# EAGLE design robot (EAGLE 6.1)

## Sheet 1 of 6
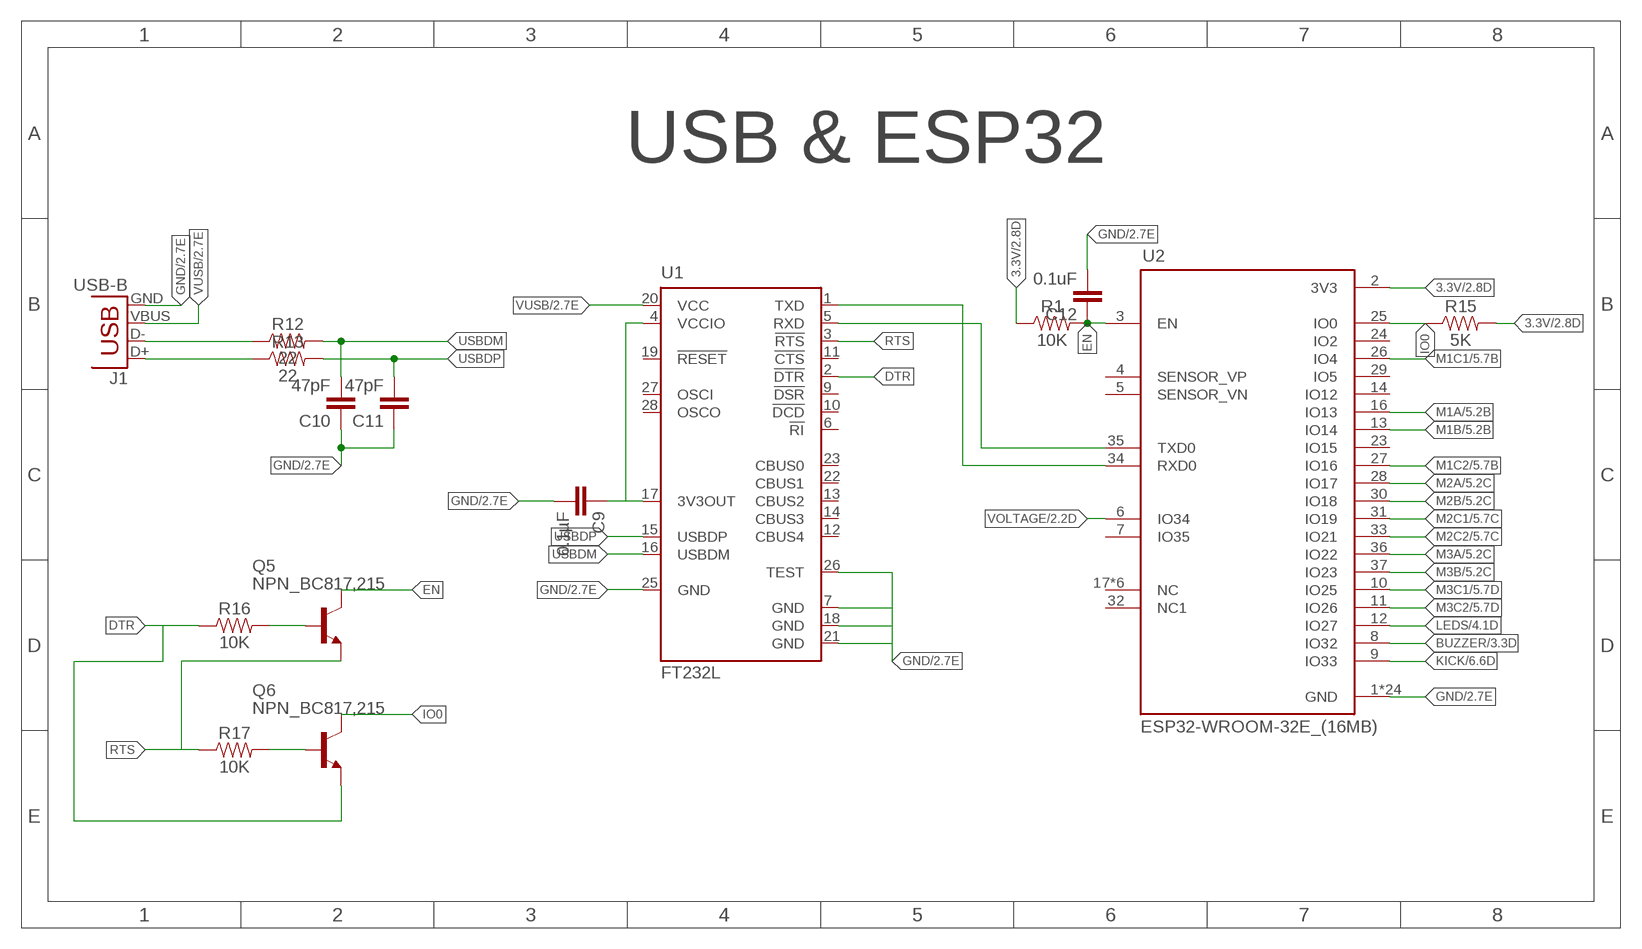
[diagram p0: schematic, sheet 1]

### Parts
C9  0.1µF  0.33UF/330NF-0805-50V-10%  [0805]
C10  47pF  CAP0805  [0805]
C11  47pF  CAP0805  [0805]
C12  0.1uF  CAP0805  [0805]
J1  USB-B  USBPTH  [USB-B-PTH]
Q5  NPN_BC817,215  [SOT-23]
Q6  NPN_BC817,215  [SOT-23]
R1  10K  0.3OHM-0805-1/8W-1%  [0805]
R12  22  0.3OHM-0805-1/8W-1%  [0805]
R13  22  0.3OHM-0805-1/8W-1%  [0805]
R15  5K  0.3OHM-0805-1/8W-1%  [0805]
R16  10K  0.3OHM-0805-1/8W-1%  [0805]
R17  10K  0.3OHM-0805-1/8W-1%  [0805]
U1  FT232L  [SSOP28]
U2  ESP32-WROOM-32E_(16MB)  [MODULE_ESP32-WROOM-32E_(16MB)]

### Nets
3.3V: R1.1 R15.2 U2.2(3V3) ; also sheet 2,3,5
BUZZER: U2.8(IO32) ; also sheet 3
DTR: Q6.2(E) R16.1 U1.2(!DTR)
EN: C12.1 Q5.3(C) R1.2 U2.3(EN)
GND [alime]: C9.2 C10.1 C11.1 C12.2 J1.GND U1.7(GND) U1.18(GND) U1.21(GND) U1.25(GND) U1.26(TEST) U2.1(GND) U2.15(GND) U2.38(GND) U2.39_1(GND) U2.39_2(GND) U2.39_3(GND) U2.39_4(GND) U2.39_5(GND) U2.39_6(GND) U2.39_7(GND) U2.39_8(GND) U2.39_9(GND) U2.39_10(GND) U2.39_11(GND) U2.39_12(GND) U2.39_13(GND) U2.39_14(GND) U2.39_15(GND) U2.39_16(GND) U2.39_17(GND) U2.39_18(GND) U2.39_19(GND) U2.39_20(GND) U2.39_21(GND) ; also sheet 2,3,4,5,6
IO0: Q6.3(C) R15.1 U2.25(IO0)
KICK: U2.9(IO33) ; also sheet 6
LEDS: U2.12(IO27) ; also sheet 4
M1A: U2.16(IO13) ; also sheet 5
M1B: U2.13(IO14) ; also sheet 5
M1C1: U2.26(IO4) ; also sheet 5
M1C2: U2.27(IO16) ; also sheet 5
M2A: U2.28(IO17) ; also sheet 5
M2B: U2.30(IO18) ; also sheet 5
M2C1: U2.31(IO19) ; also sheet 5
M2C2: U2.33(IO21) ; also sheet 5
M3A: U2.36(IO22) ; also sheet 5
M3B: U2.37(IO23) ; also sheet 5
M3C1: U2.10(IO25) ; also sheet 5
M3C2: U2.11(IO26) ; also sheet 5
N$6: U1.1(TXD) U2.34(RXD0)
N$14: U1.5(RXD) U2.35(TXD0)
N$15: C9.1 U1.4(VCCIO) U1.17(3V3OUT)
N$16: Q5.1(B) R16.2
N$17: Q6.1(B) R17.2
N$59: J1.D- R12.1
N$60: J1.D+ R13.1
RTS: Q5.2(E) R17.1 U1.3(!RTS)
USBDM: C10.2 R12.2 U1.16(USBDM)
USBDP: C11.2 R13.2 U1.15(USBDP)
VOLTAGE: U2.6(IO34) ; also sheet 2
VUSB [alime]: J1.VBUS U1.20(VCC) ; also sheet 2
Unconnected: U1.6(!RI) U1.9(!DSR) U1.10(!DCD) U1.11(!CTS) U1.12(CBUS4) U1.13(CBUS2) U1.14(CBUS3) U1.19(!RESET) U1.22(CBUS1) U1.23(CBUS0) U1.27(OSCI) U1.28(OSCO) U2.4(SENSOR_VP) U2.5(SENSOR_VN) U2.7(IO35) U2.14(IO12) U2.17(NC) U2.18(NC) U2.19(NC) U2.20(NC) U2.21(NC) U2.22(NC) U2.23(IO15) U2.24(IO2) U2.29(IO5) U2.32(NC1)

### Notes on the sheet
- USB & ESP32

## Sheet 2 of 6
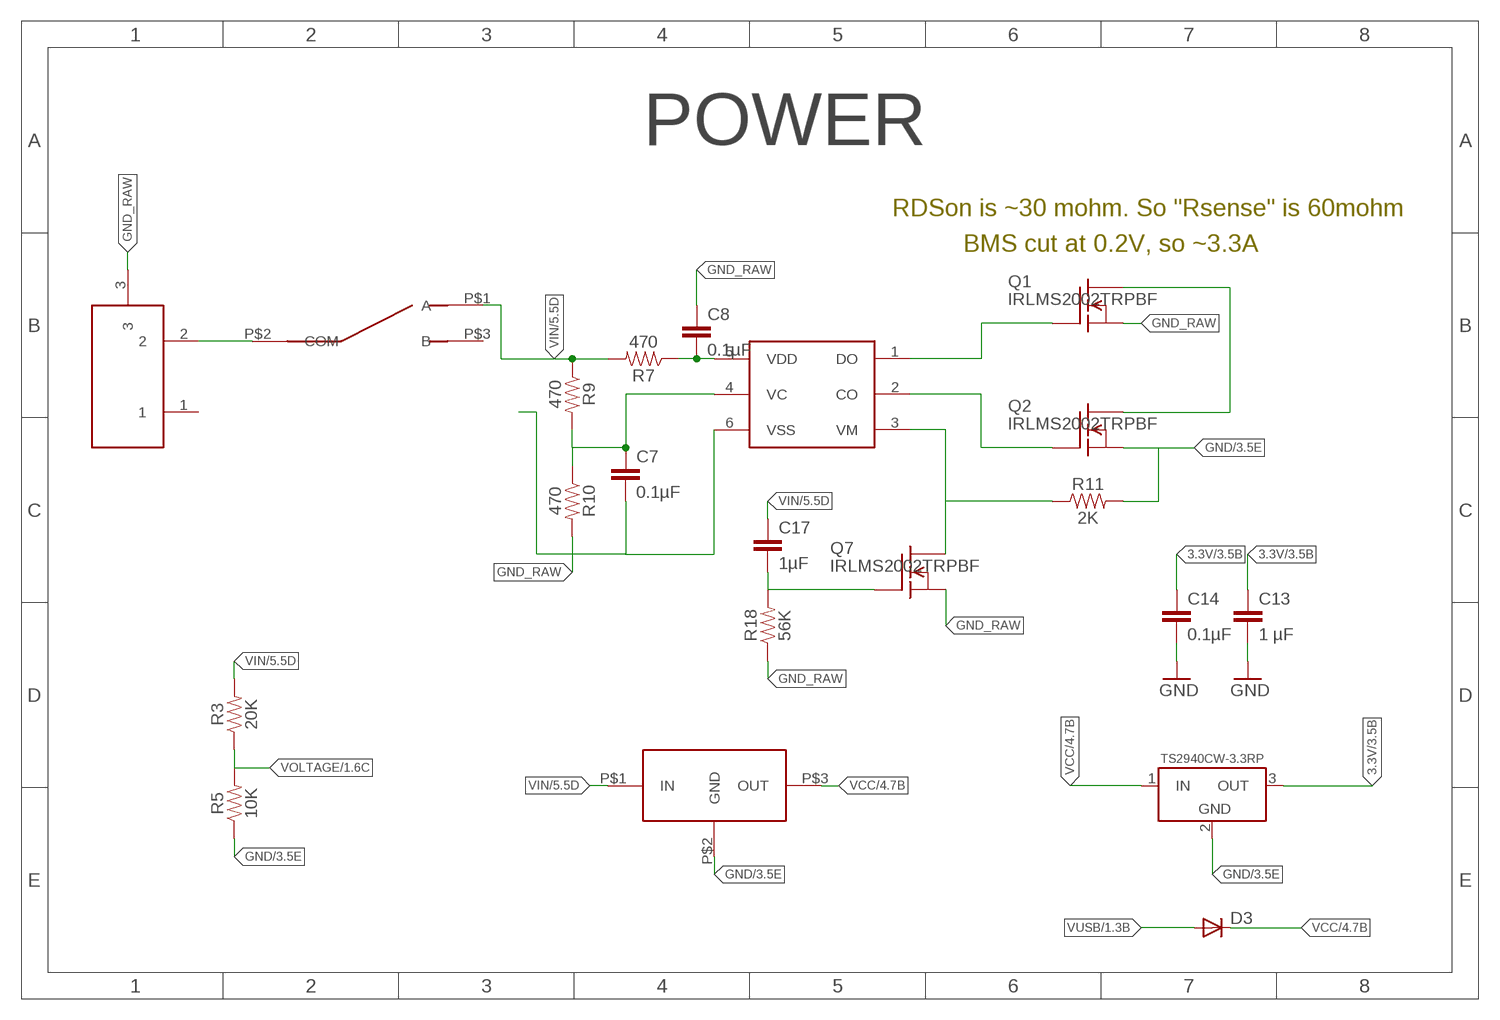
[diagram p1: schematic, sheet 2]

### Parts
C7  0.1µF  0.33UF/330NF-0805-50V-10%  [0805]
C8  0.1µF  0.33UF/330NF-0805-50V-10%  [0805]
C13  1 µF  0.33UF/330NF-0805-50V-10%  [0805]
C14  0.1µF  0.33UF/330NF-0805-50V-10%  [0805]
C17  1µF  0.33UF/330NF-0805-50V-10%  [0805]
D3  DIODESOD  [SOD-323]
J2  DC21MMX  [DC-21MM]
Q1  IRLMS2002TRPBF  [SOT23-6]
Q2  IRLMS2002TRPBF  [SOT23-6]
Q7  IRLMS2002TRPBF  [SOT23-6]
R3  20K  0.3OHM-0805-1/8W-1%  [0805]
R5  10K  0.3OHM-0805-1/8W-1%  [0805]
R7  470  0.3OHM-0805-1/8W-1%  [0805]
R9  470  0.3OHM-0805-1/8W-1%  [0805]
R10  470  0.3OHM-0805-1/8W-1%  [0805]
R11  2K  0.3OHM-0805-1/8W-1%  [0805]
R18  56K  0.3OHM-0805-1/8W-1%  [0805]
REG1  REG_5V  [TRACOPOWER]
U3  S8252  [SOT23-6]
U$1  L102011ML04Q  [L102011ML04Q]
U$25  TS2940CW-3.3RP  [SOT223]

### Nets
3.3V: C13.1 C14.1 U$25.3(OUT) ; also sheet 1,3,5
GND [alime]: C13.2 C14.2 Q2.4(S) R5.1 R11.2 REG1.P$2(GND) U$25.2(GND) ; also sheet 1,3,4,5,6
GND_RAW [alime]: C7.2 C8.1 J2.3 Q1.4(S) Q7.4(S) R10.2 R18.1 U3.6(VSS)
N$7 [alime]: J2.2 U$1.P$2(COM)
N$8: C8.2 R7.1 U3.5(VDD)
N$9: C7.1 R9.2 R10.1 U3.4(VC)
N$10: Q1.1(D) Q1.2(D) Q1.5(D) Q1.6(D) Q2.1(D) Q2.2(D) Q2.5(D) Q2.6(D)
N$11: Q2.3(G) U3.2(CO)
N$12: Q1.3(G) U3.1(DO)
N$13: Q7.1(D) Q7.2(D) Q7.5(D) Q7.6(D) R11.1 U3.3(VM)
N$19: C17.2 Q7.3(G) R18.2
VCC [alime]: D3.1(C) REG1.P$3(OUT) U$25.1(IN) ; also sheet 4
VIN [alime]: C17.1 R3.2 R7.2 R9.1 REG1.P$1(IN) U$1.P$1(A) ; also sheet 5,6
VOLTAGE: R3.1 R5.2 ; also sheet 1
VUSB [alime]: D3.2(A) ; also sheet 1
Unconnected: U$1.P$3(B)

### Notes on the sheet
- POWER
- RDSon is ~30 mohm. So "Rsense" is 60mohm
- BMS cut at 0.2V, so ~3.3A

## Sheet 3 of 6
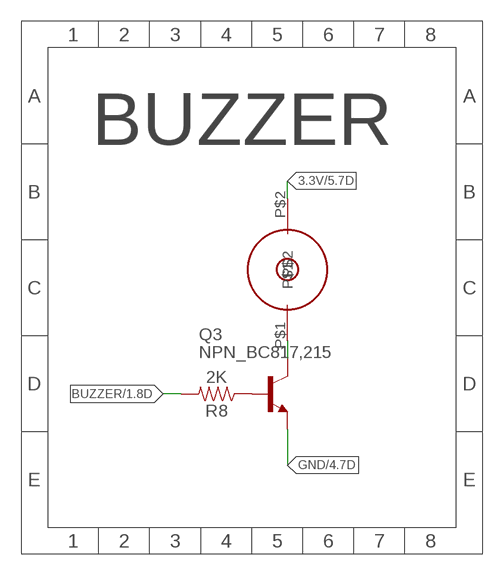
[diagram p2: schematic, sheet 3]

### Parts
B1  BUZZER66  [BUZZER66]
Q3  NPN_BC817,215  [SOT-23]
R8  2K  0.3OHM-0805-1/8W-1%  [0805]

### Nets
3.3V: B1.P$2 ; also sheet 1,2,5
BUZZER: R8.2 ; also sheet 1
GND [alime]: Q3.2(E) ; also sheet 1,2,4,5,6
N$3: Q3.1(B) R8.1
N$5: B1.P$1 Q3.3(C)

### Notes on the sheet
- BUZZER

## Sheet 4 of 6
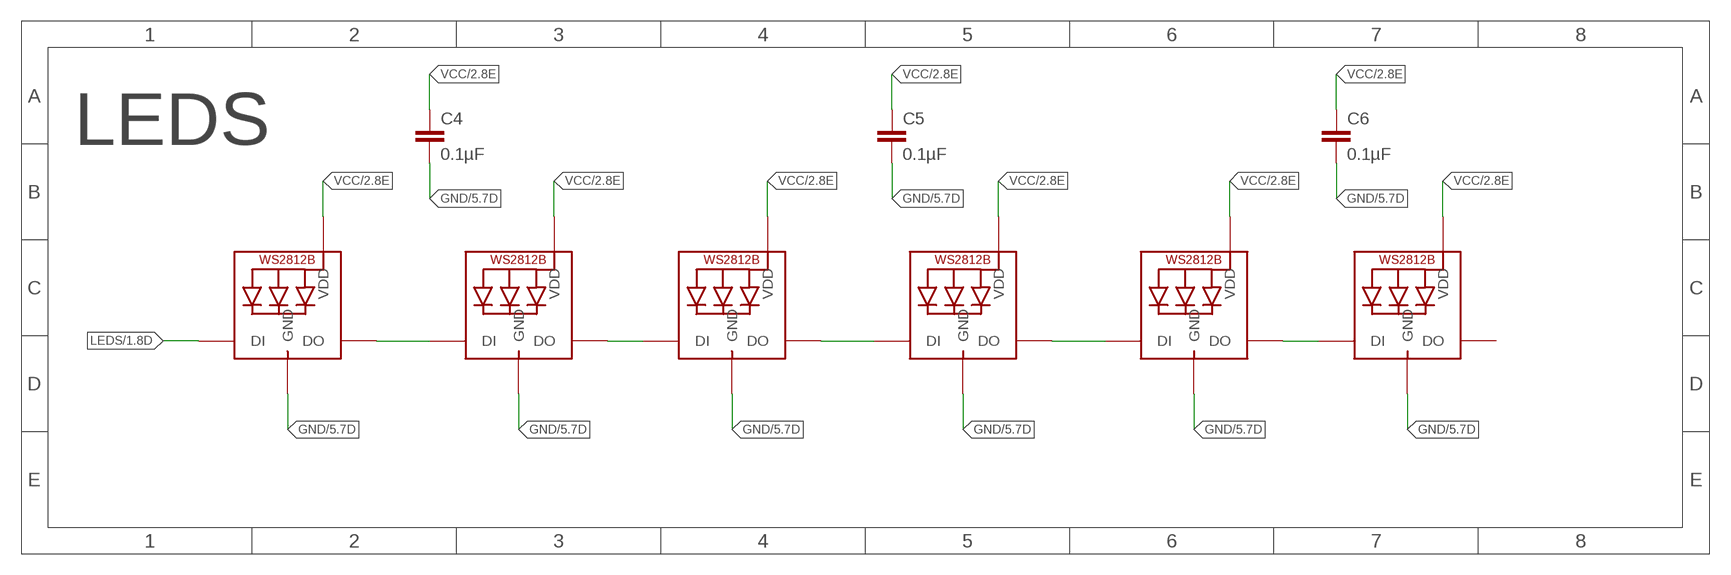
[diagram p3: schematic, sheet 4]

### Parts
C4  0.1µF  0.33UF/330NF-0805-50V-10%  [0805]
C5  0.1µF  0.33UF/330NF-0805-50V-10%  [0805]
C6  0.1µF  0.33UF/330NF-0805-50V-10%  [0805]
LED1  WS2812B5050  [WS2812B]
LED2  WS2812B5050  [WS2812B]
LED3  WS2812B5050  [WS2812B]
LED4  WS2812B5050  [WS2812B]
LED5  WS2812B5050  [WS2812B]
LED6  WS2812B5050  [WS2812B]

### Nets
GND [alime]: C4.2 C5.2 C6.2 LED1.3-GND(GND) LED2.3-GND(GND) LED3.3-GND(GND) LED4.3-GND(GND) LED5.3-GND(GND) LED6.3-GND(GND) ; also sheet 1,2,3,5,6
LEDS: LED1.4-DIN(DI) ; also sheet 1
N$27: LED1.2-DOUT(DO) LED2.4-DIN(DI)
N$28: LED2.2-DOUT(DO) LED3.4-DIN(DI)
N$30: LED4.2-DOUT(DO) LED5.4-DIN(DI)
N$32: LED5.2-DOUT(DO) LED6.4-DIN(DI)
N$39: LED3.2-DOUT(DO) LED4.4-DIN(DI)
VCC [alime]: C4.1 C5.1 C6.1 LED1.1-VDD(VDD) LED2.1-VDD(VDD) LED3.1-VDD(VDD) LED4.1-VDD(VDD) LED5.1-VDD(VDD) LED6.1-VDD(VDD) ; also sheet 2
Unconnected: LED6.2-DOUT(DO)

### Notes on the sheet
- LEDS

## Sheet 5 of 6
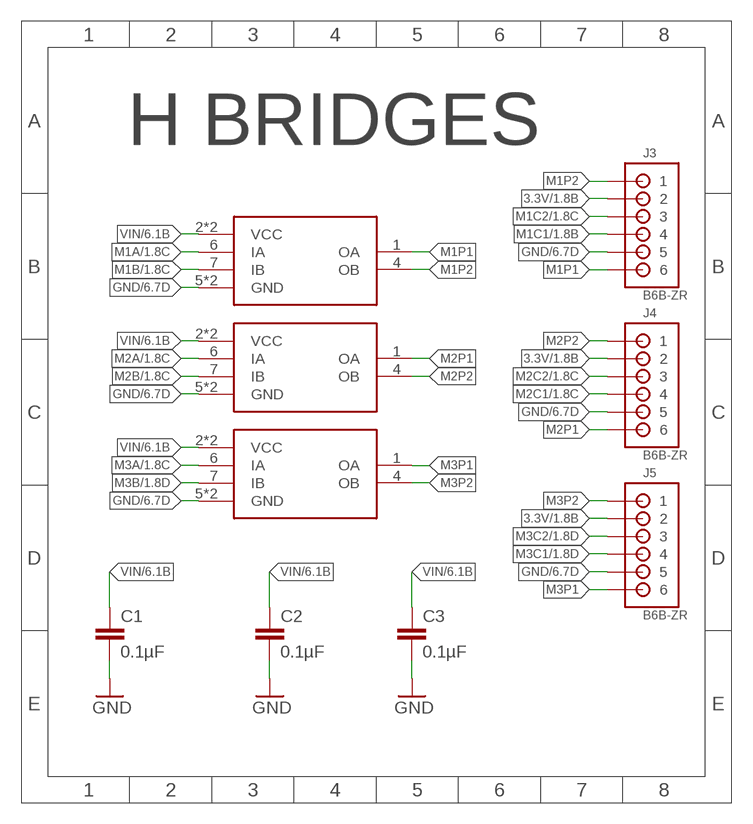
[diagram p4: schematic, sheet 5]

### Parts
C1  0.1µF  0.33UF/330NF-0805-50V-10%  [0805]
C2  0.1µF  0.33UF/330NF-0805-50V-10%  [0805]
C3  0.1µF  0.33UF/330NF-0805-50V-10%  [0805]
J3  B6B-ZR  [B6B-ZR]
J4  B6B-ZR  [B6B-ZR]
J5  B6B-ZR  [B6B-ZR]
U4  L9110  [SO8]
U5  L9110  [SO8]
U6  L9110  [SO8]

### Nets
3.3V: J3.2 J4.2 J5.2 ; also sheet 1,2,3
GND [alime]: C1.2 C2.2 C3.2 J3.5 J4.5 J5.5 U4.5(GND) U4.8(GND) U5.5(GND) U5.8(GND) U6.5(GND) U6.8(GND) ; also sheet 1,2,3,4,6
M1A: U4.6(IA) ; also sheet 1
M1B: U4.7(IB) ; also sheet 1
M1C1: J3.4 ; also sheet 1
M1C2: J3.3 ; also sheet 1
M1P1 [alime]: J3.6 U4.1(OA)
M1P2 [alime]: J3.1 U4.4(OB)
M2A: U5.6(IA) ; also sheet 1
M2B: U5.7(IB) ; also sheet 1
M2C1: J4.4 ; also sheet 1
M2C2: J4.3 ; also sheet 1
M2P1 [alime]: J4.6 U5.1(OA)
M2P2 [alime]: J4.1 U5.4(OB)
M3A: U6.6(IA) ; also sheet 1
M3B: U6.7(IB) ; also sheet 1
M3C1: J5.4 ; also sheet 1
M3C2: J5.3 ; also sheet 1
M3P1 [alime]: J5.6 U6.1(OA)
M3P2 [alime]: J5.1 U6.4(OB)
VIN [alime]: C1.1 C2.1 C3.1 U4.2(VCC) U4.3(VCC) U5.2(VCC) U5.3(VCC) U6.2(VCC) U6.3(VCC) ; also sheet 2,6

### Notes on the sheet
- H BRIDGES

## Sheet 6 of 6
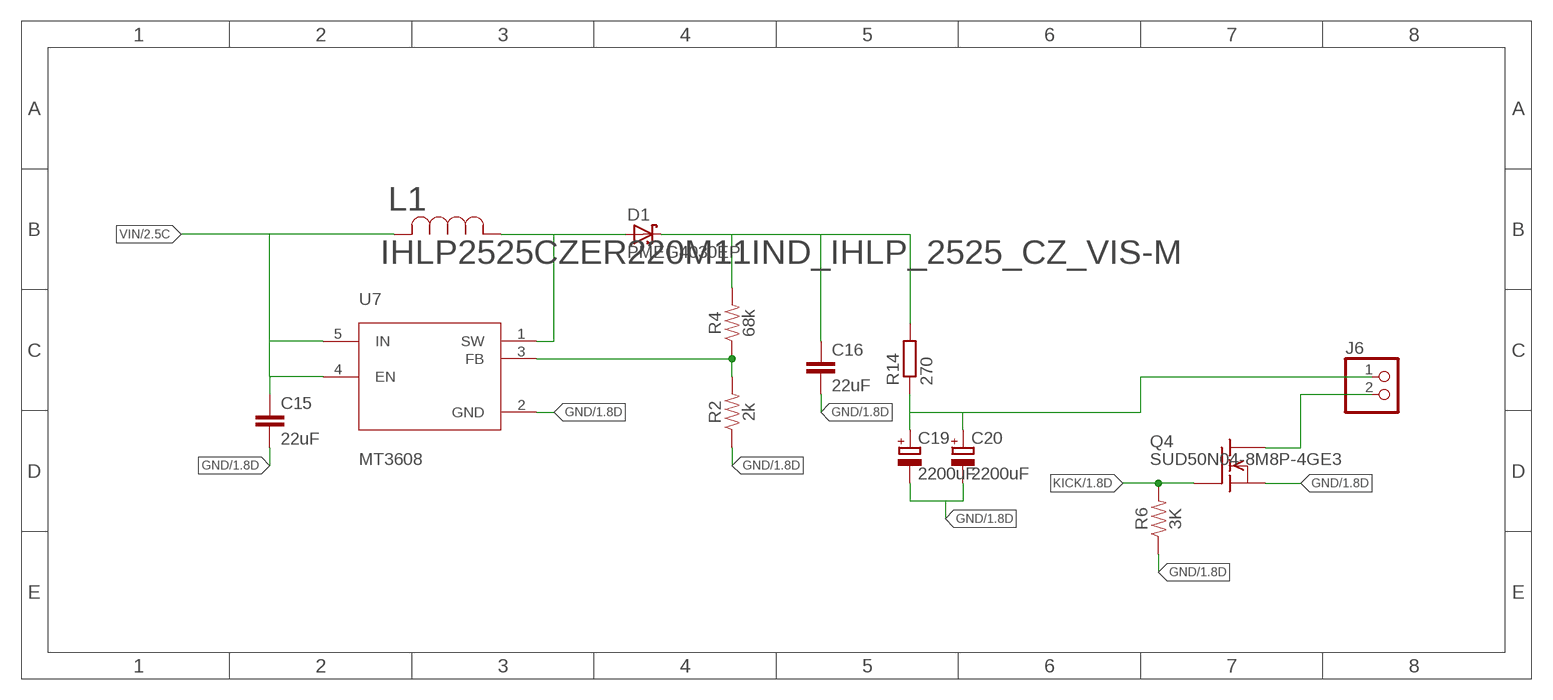
[diagram p5: schematic, sheet 6]

### Parts
C15  22uF  C-EUC0805  [C0805]
C16  22uF  C-EUC0805  [C0805]
C19  2200uF  CPOL-EUE5-13  [E5-13]
C20  2200uF  CPOL-EUE5-13  [E5-13]
D1  PMEG4030EP  [SOD128]
J6  KICKER  [KICKER]
L1  IHLP2525CZER220M11IND_IHLP_2525_CZ_VIS-M  [IND_IHLP_2525_CZ_VIS-M]
Q4  SUD50N04-8M8P-4GE3  [TO252]
R2  2k  0.3OHM-0805-1/8W-1%  [0805]
R4  68k  0.3OHM-0805-1/8W-1%  [0805]
R6  3K  0.3OHM-0805-1/8W-1%  [0805]
R14  270  R-EU_R2010  [R2010]
U7  MT3608  [SOT95P280X145-6N]

### Nets
GND [alime]: C15.2 C16.2 C19.- C20.- Q4.2(S) R2.1 R6.1 U7.2(GND) ; also sheet 1,2,3,4,5
KICK: Q4.1(G) R6.2 ; also sheet 1
KICKER: J6.2 Q4.3(D)
N$1: D1.2(A) L1.1 U7.1(SW)
N$2: C16.1 D1.1(K) R4.2 R14.2
N$4: R2.2 R4.1 U7.3(FB)
VIN [alime]: C15.1 L1.2 U7.4(EN) U7.5(IN) ; also sheet 2,5
VSTORE: C19.+ C20.+ J6.1 R14.1

## Power pins joined to a net without a drawn wire
1: J2.1

## Library data of the parts
B1 = rhoban:BUZZER; FARNELL: CEM-1203
C1-C9 C13 C14 = SparkFun-Capacitors:0.33UF/330NF: 0.33µF/330nF ceramic capacitors A capacitor is a passive two-terminal electrical component used to store electrical energy temporarily in an electric field.; FARNELL: 2688486RL; PROD_ID: CAP-08469; VALUE: 0.33µF
C10-C12 = SparkFun-Passives:CAP: Capacitor Standard 0603 ceramic capacitor, and 0.1" leaded capacitor.; FARNELL: 1081223
C15 C16 = resistor:C-EU: CAPACITOR, European symbol; FARNELL: 2666560
C17 = SparkFun-Capacitors:0.33UF/330NF: 0.33µF/330nF ceramic capacitors A capacitor is a passive two-terminal electrical component used to store electrical energy temporarily in an electric field.; FARNELL: 3010154; PROD_ID: CAP-08469; VALUE: 0.33µF
C19 C20 = rcl:CPOL-EU: POLARIZED CAPACITOR, European symbol; FARNELL: 2749341
D1 = nxp_60:PMEG4030E: 40 V, 3 A low VF MEGA Schottky barrier rectifier Planar Maximum Efficiency General Application (MEGA) Schottky barrier rectifier with an integrated guard ring for stress protection. AAL Eindhoven MK; FARNELL: 1829201
D3 = SparkFun-DiscreteSemi:DIODE: Diode These are standard reverse protection diodes and small signal diodes. SMA package can handle up to about 1A. SOD-323 can handle about 200mA. What the SOD-323 package when ordering, there are some mfgs out there that are 5-pin packages.; FARNELL: 8737843RL
J1 = SparkFun-Connectors:USB: USB Connectors USB-B-PTH is fully proven SKU : PRT-00139/CONN-08278 USB-miniB is fully proven SKU : PRT-00587 USB-A-PCB is untested. USB-A-H is throughly reviewed, but untested. Spark Fun Electronics SKU : PRT-00437 USB-B-SMT is throughly reviewed, but untested. Needs silkscreen touching up. USB-A-S has not been used/tested USB-MB-H has not been used/tested USB-MICROB has been used. CONN-09505; FARNELL: 1308876; PROD_ID: CONN-08278
J2 = powersupply:DC21MM; FARNELL: 1217037
J3-J5 = jst:B6B-ZR: JST-ZH Connector 6 pol, 1.5mm pitch Package: B6B-ZR Source: http://www.jst-mfg.com/product/pdf/eng/eZH.pdf; FARNELL: 9491805
J6 = rhoban:KICKER; FARNELL: JF-0530B
L1 = INDUCTOR:IHLP2525CZER220M11; BUILT_BY: EMA_UL_Team; FARNELL: 1741369; MANUFACTURER_PART_NUMBER: IHLP2525CZER220M11; SOURCELIBRARY: Vishay_2020-02-10; VENDOR: Vishay
LED1-LED6 = adafruit:WS2812B; FARNELL: WS2812B 5050
Q1 Q2 Q7 = rhoban:IRLMS2002TRPBF; FARNELL: 2577180RL
Q3 Q5 Q6 = rhoban:NPN; FARNELL: 1081223
Q4 = rhoban:SUD50N04-8M8P-4GE3; FARNELL: 1794799
R1 R12 R13 R15-R17 = SparkFun-Resistors:0.3OHM: 0.3Ω resistor A resistor is a passive two-terminal electrical component that implements electrical resistance as a circuit element. Resistors act to reduce current flow, and, at the same time, act to lower voltage levels within circuits. - Wikipedia; FARNELL: 2446926; PROD_ID: RES-11622; VALUE: 0.3
R2 R8 R11 = SparkFun-Resistors:0.3OHM: 0.3Ω resistor A resistor is a passive two-terminal electrical component that implements electrical resistance as a circuit element. Resistors act to reduce current flow, and, at the same time, act to lower voltage levels within circuits. - Wikipedia; FARNELL: 2447622; PROD_ID: RES-11622; VALUE: 0.3
R3 = SparkFun-Resistors:0.3OHM: 0.3Ω resistor A resistor is a passive two-terminal electrical component that implements electrical resistance as a circuit element. Resistors act to reduce current flow, and, at the same time, act to lower voltage levels within circuits. - Wikipedia; FARNELL: 2074395; PROD_ID: RES-11622; VALUE: 0.3
R4 = SparkFun-Resistors:0.3OHM: 0.3Ω resistor A resistor is a passive two-terminal electrical component that implements electrical resistance as a circuit element. Resistors act to reduce current flow, and, at the same time, act to lower voltage levels within circuits. - Wikipedia; FARNELL: 2447023; PROD_ID: RES-11622; VALUE: 0.3
R5 R9 R10 = SparkFun-Resistors:0.3OHM: 0.3Ω resistor A resistor is a passive two-terminal electrical component that implements electrical resistance as a circuit element. Resistors act to reduce current flow, and, at the same time, act to lower voltage levels within circuits. - Wikipedia; FARNELL: 2074334RL; PROD_ID: RES-11622; VALUE: 0.3
R6 = SparkFun-Resistors:0.3OHM: 0.3Ω resistor A resistor is a passive two-terminal electrical component that implements electrical resistance as a circuit element. Resistors act to reduce current flow, and, at the same time, act to lower voltage levels within circuits. - Wikipedia; FARNELL: 1887603; PROD_ID: RES-11622; VALUE: 0.3
R7 = SparkFun-Resistors:0.3OHM: 0.3Ω resistor A resistor is a passive two-terminal electrical component that implements electrical resistance as a circuit element. Resistors act to reduce current flow, and, at the same time, act to lower voltage levels within circuits. - Wikipedia; FARNELL: 2447662; PROD_ID: RES-11622; VALUE: 0.3
R14 = rcl:R-EU_: RESISTOR, European symbol; FARNELL: 1887603
R18 = SparkFun-Resistors:0.3OHM: 0.3Ω resistor A resistor is a passive two-terminal electrical component that implements electrical resistance as a circuit element. Resistors act to reduce current flow, and, at the same time, act to lower voltage levels within circuits. - Wikipedia; FARNELL: 2074486; PROD_ID: RES-11622; VALUE: 0.3
REG1 = rhoban:REG_5V; FARNELL: 1696320
U1 = rhoban:FT232: Source: http://www.ftdichip.com/Documents/DataSheets/DS_FT232R_v104.pdf; DATASHEET: ft232rl.pdf; FARNELL: 1146032; FARNELL_LINK: http://fr.farnell.com/ftdi/ft232rl/usb-vers-uart-cms-ssop28-232/dp/1146032?Ntt=1146032; MPN: FT232RL; OC_FARNELL: 1146032; OC_NEWARK: 91K9918
U2 = ESP32-WROOM-32E__16MB_:ESP32-WROOM-32E_(16MB): Bluetooth, WiFi 802.11b/g/n, Bluetooth v4.2 +EDR, Class 1, 2 and 3 Transceiver Module 2.4GHz ~ 2.5GHz Integrated, Trace Surface Mount Check availability; AVAILABILITY: In Stock; DESCRIPTION: Bluetooth, WiFi 802.11b/g/n, Bluetooth v4.2 +EDR, Class 1, 2 and 3 Transceiver Module 2.4GHz ~ 2.5GHz Integrated, Trace Surface Mount; FARNELL: ESP32-WROOM; MF: Espressif Systems; MP: ESP32-WROOM-32E (16MB); PACKAGE: SMD-44 Espressif Systems; PRICE: None
U3 = rhoban:S8252; FARNELL: https://www.digikey.fr/fr/products/detail/ablic-u-s-a-inc/S-8252AAL-M6T1U/6121452; REF: S-8252AAL-M6T1U
U4-U6 = rhoban:L9110; FARNELL: L9110 SOIC8
U7 = MT3608:MT3608: High Efficiency 1.2MHz 2A Step Up Converter Check prices; AVAILABILITY: No availability data; DESCRIPTION: High Efficiency 1.2MHz 2A Step Up Converter; FARNELL: MT3608; MF: Aerosemi Technology Co., Ltd; MP: MT3608; PACKAGE: Package; PRICE: None
U$1 = rhoban:L102011ML04Q
U$25 = rhoban:TS2940CW-3.3RP; FARNELL: 7261403

## Net classes
0 default: width 0.203 mm
1 alime: width 0.508 mm
2 bigalime: width 0.381 mm

## Board
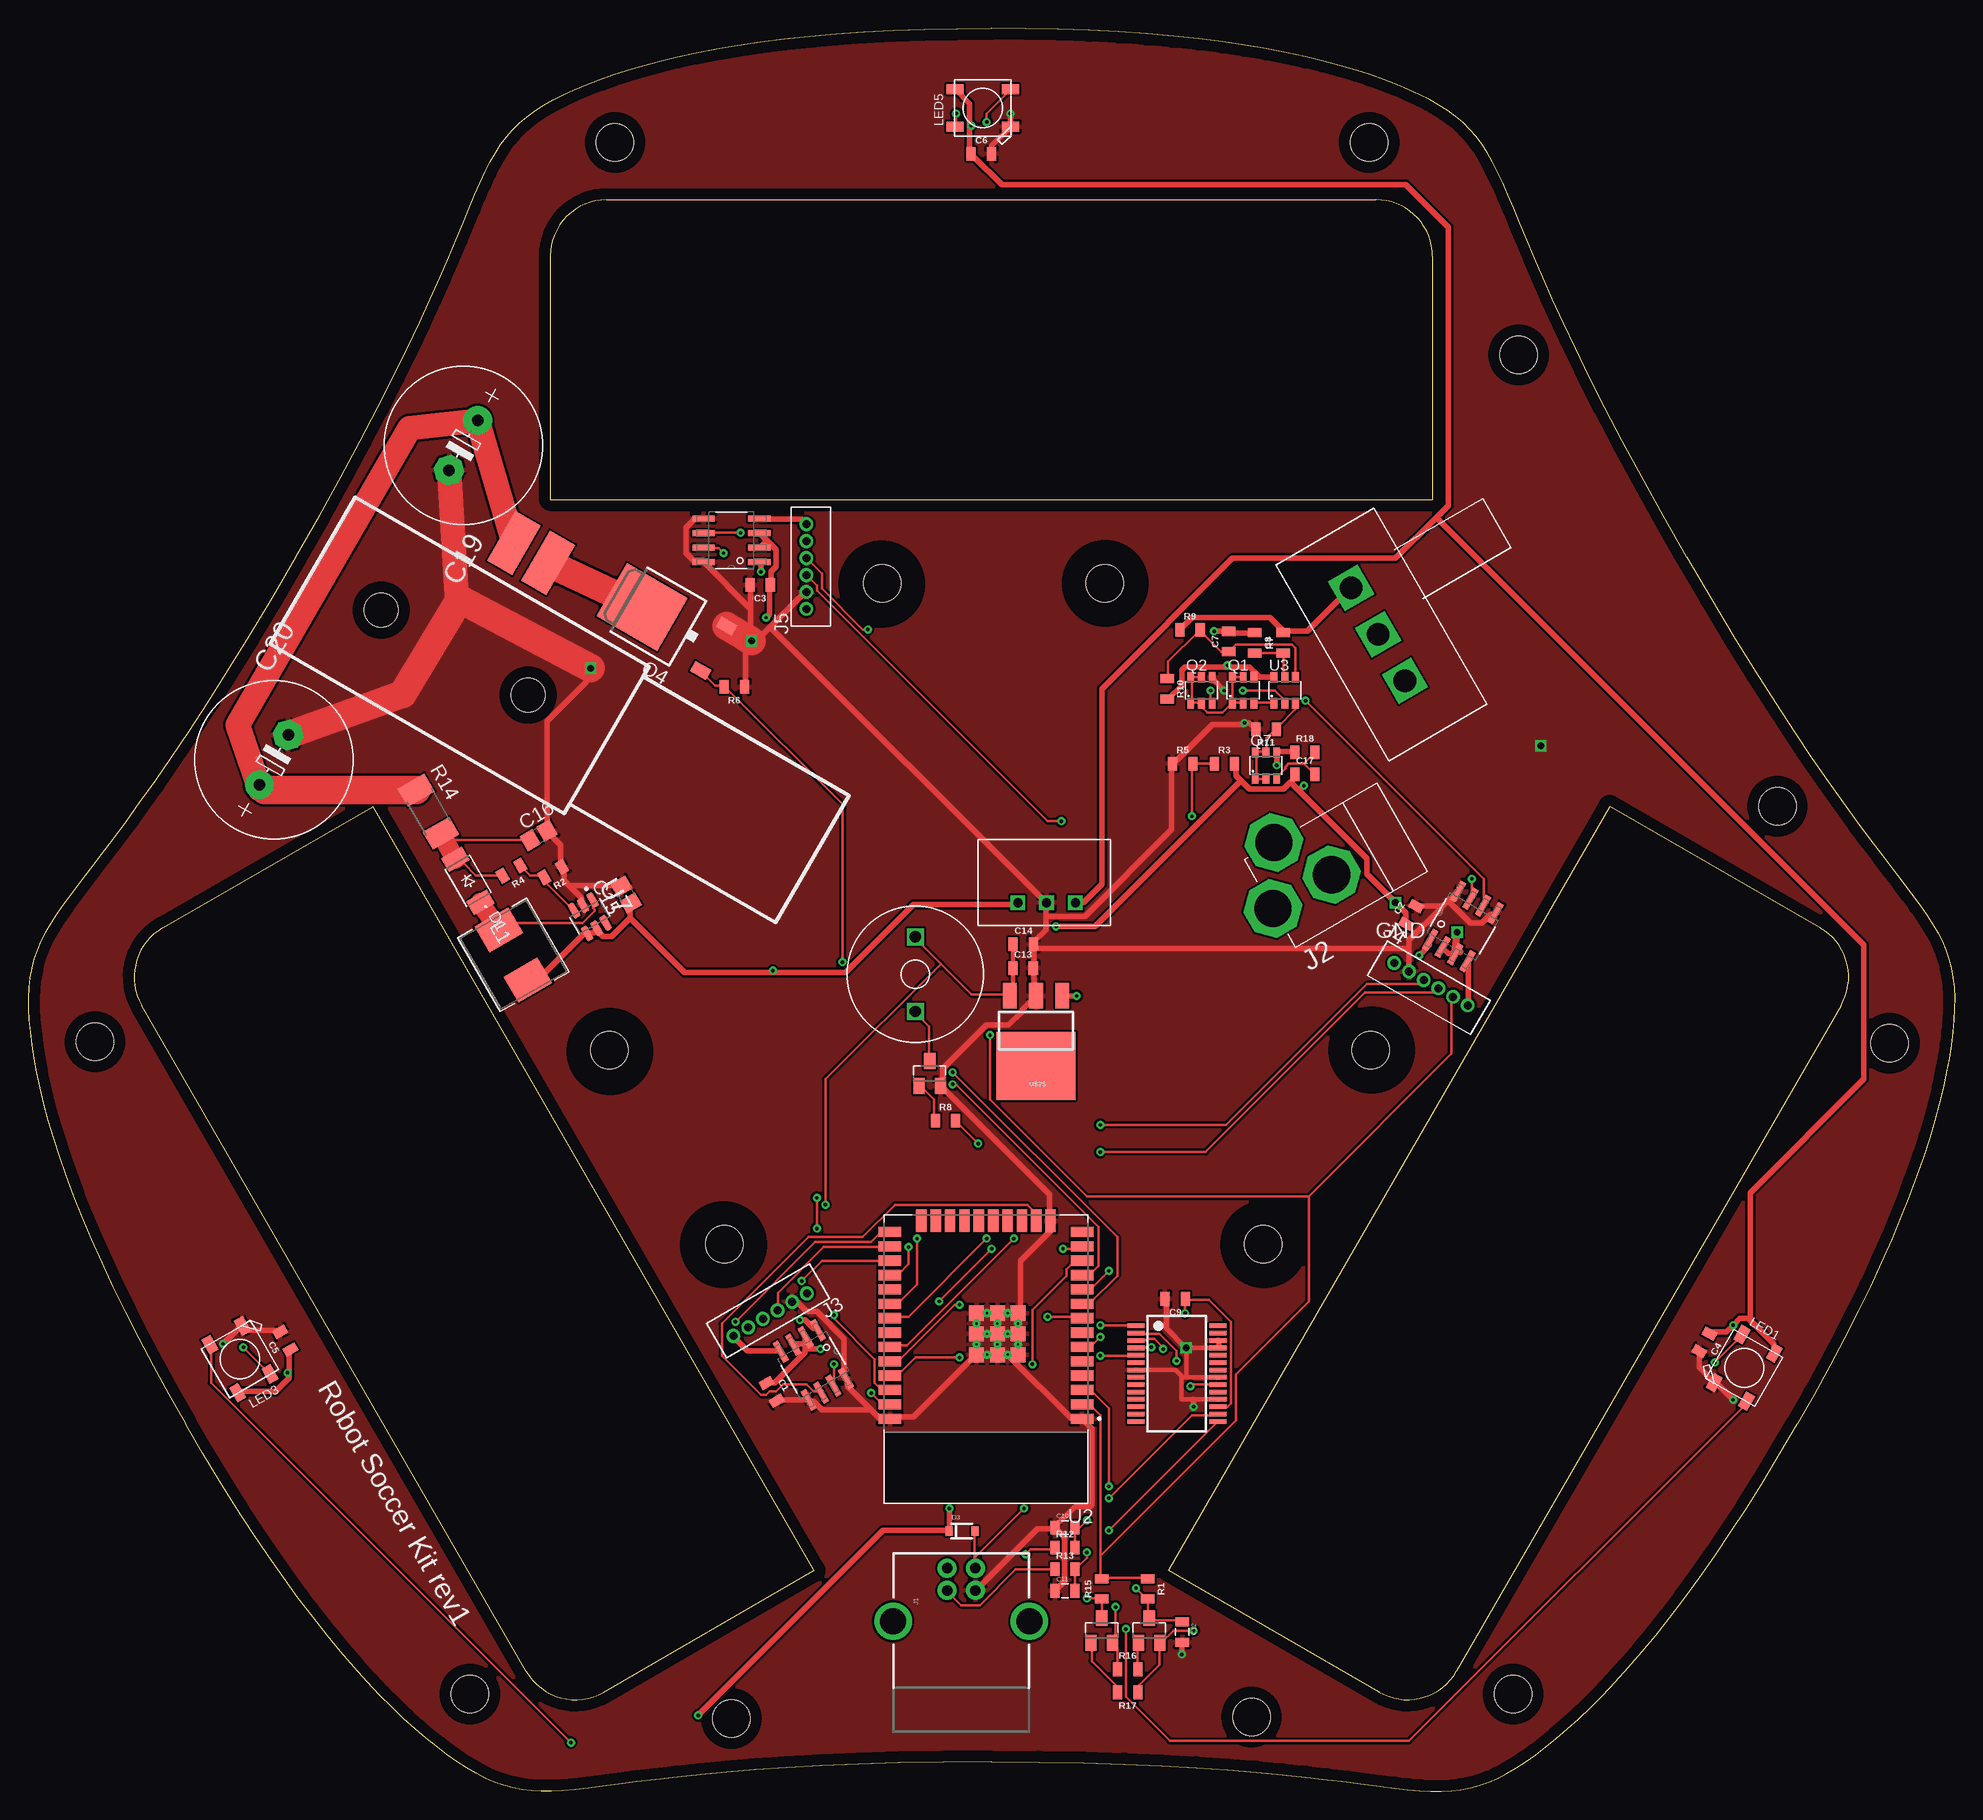
[diagram p6: board, top side]
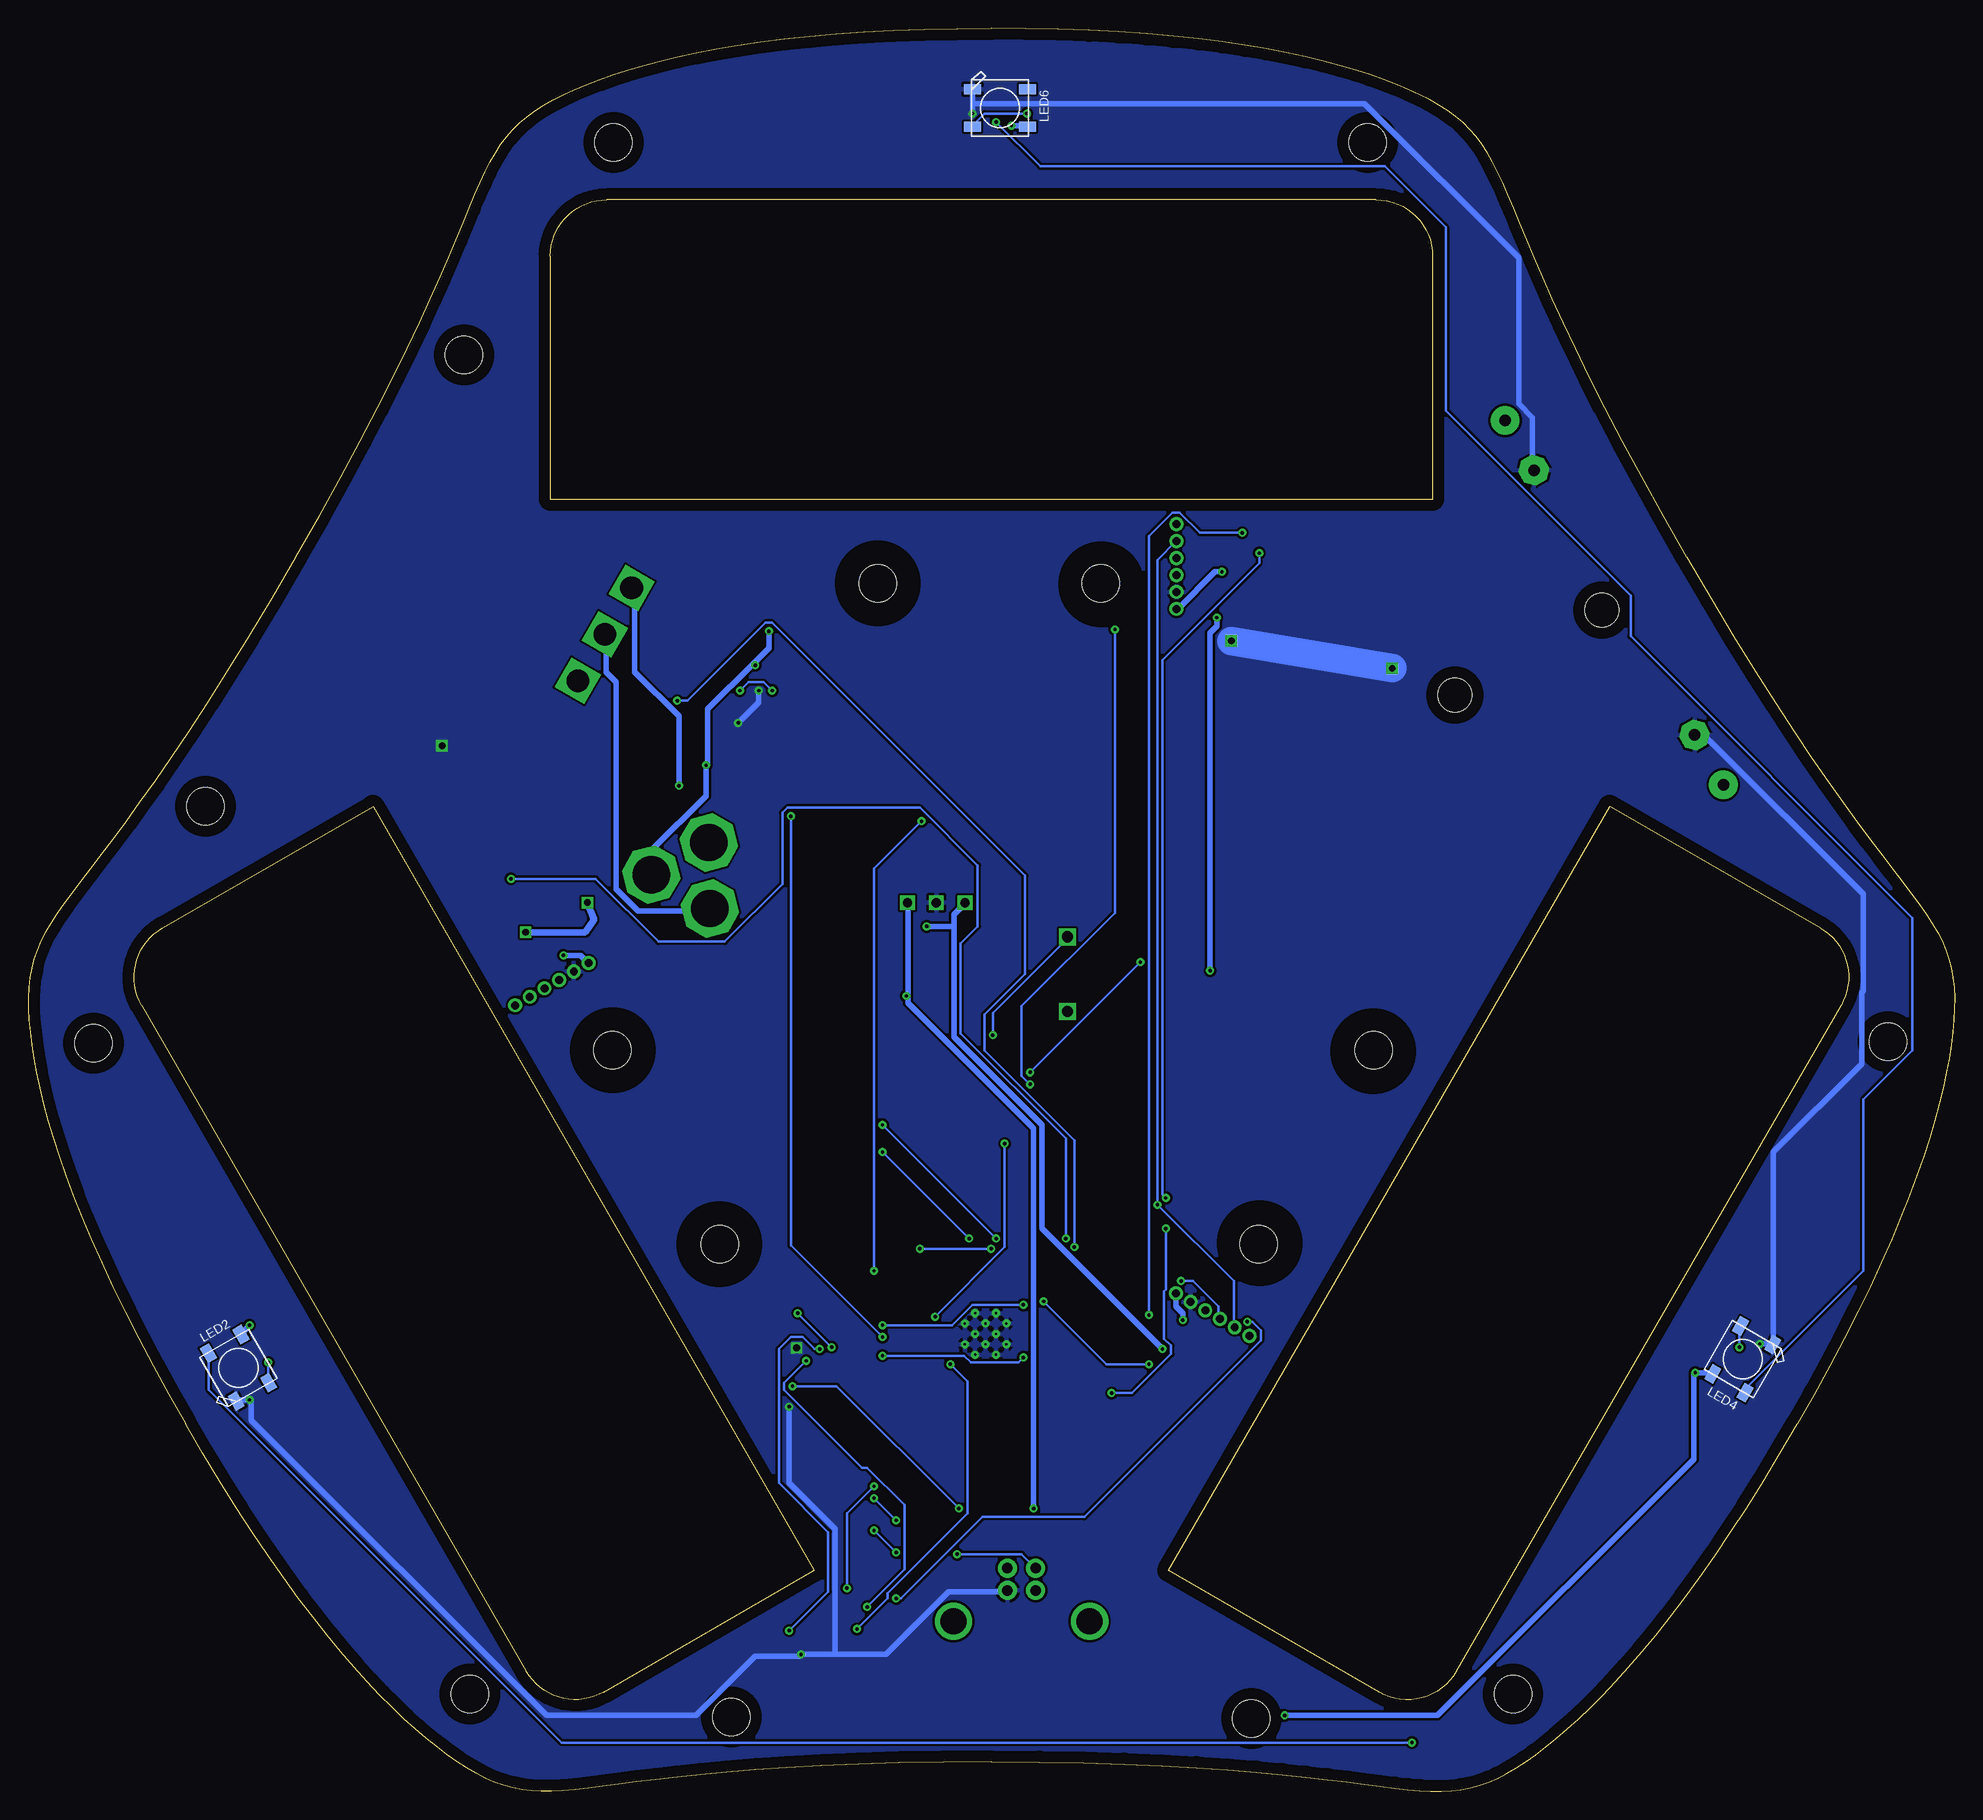
[diagram p7: board, bottom side, seen from below]

Size 170.28 x 155.86 mm. Coordinates in mm from the lower left corner, seen from the top.
Outline: 300 segments
Copper layers (1*16): Top 0.035mm / dielectric 1.5mm / Bottom 0.035mm
Design rules: minimum track width 6mil, minimum drill 0.3mm, track to track 0.205mm, track to pad 0.205mm, pad to pad 0.205mm, via to via 0.205mm, smd to smd 8mil, copper to edge 40mil, drill to drill 8mil, minimum pad ring 10mil, minimum via ring 8mil, stop-mask expansion 4mil, vias tented up to drill 25mil, thermal gap 10mil
tRestrict: area 47.6,61.6 to 55.2,69.2; area 57.6,44.5 to 65.3,52.2; area 114.9,61.7 to 122.6,69.4; area 105.4,44.5 to 113.1,52.2; area 71.6,102.9 to 79.3,110.6; area 91.4,103 to 99,110.6
bRestrict: area 47.6,61.6 to 55.2,69.2; area 57.7,44.7 to 65.2,52.2; area 114.8,61.8 to 122.4,69.3; area 105.4,44.6 to 113,52.1; area 71.6,102.9 to 79.2,110.5; area 91.4,103 to 98.9,110.6

### Footprints (pad centres in the part's own frame; a part is rotated, then mirrored left to right if it is on the bottom)
BUZZER66 = drill 1 square: P$1 -3.3,0; P$2 3.3,0
0805 = smd 0.8 x 1.2: 1 -0.9,0; 2 0.9,0
C0805 = smd 1.3 x 1.5: 1 -0.85,0; 2 0.85,0
E5-13 = drill 1.016 pad 2.54: + -2.54,0 | drill 1.016 pad 2.54 octagon: - 2.54,0
SOD128 = smd 1.4 x 2.1: 1 -2.2,0; 2 2.2,0
SOD-323 = smd 0.63 x 0.83: 1 -1.15,0; 2 1.15,0
USB-B-PTH = drill 0.914 pad 1.676: D+ 0,1.25; D- 1.981,1.25; GND 0,-1.25; VBUS 1.981,-1.25 | drill 2.286: S1 -2.718,-6.02; S2 -2.718,6.02
DC-21MM = drill 3.302 pad 4.826 octagon: 1 -5.08,-3.353; 2 -0.076,-6.35; 3 -0.076,-0.356
B6B-ZR = drill 0.7: 1 9,-1.3; 2 7.5,-1.3; 3 6,-1.3; 4 4.5,-1.3; 5 3,-1.3; 6 1.5,-1.3
KICKER = smd 2.54 x 5.08: 1 14.2,18.5; 2 17.7,18.5 | hole 3: 7,7.5; 22,7.5
IND_IHLP_2525_CZ_VIS-M = smd 2.625 x 3.429: 1 -2.557,0; 2 2.557,0
WS2812B = smd 1.5 x 0.9: 1-VDD 2.45,-1.65; 2-DOUT 2.45,1.65; 3-GND -2.45,1.65; 4-DIN -2.45,-1.65
SOT23-6 = smd 0.6 x 0.9: 1 -0.95,-1.15; 2 0,-1.15; 3 0.95,-1.15; 4 0.95,1.15; 5 0,1.15; 6 -0.95,1.15
SOT-23 = smd 1 x 1.4: 1 -0.95,-1.1; 2 0.95,-1.1; 3 0,1.1
TO252 = smd 1 x 1.6: 1 -2.28,-4.8; 2 2.28,-4.8 | smd 5.4 x 6.2: 3 0,2.5
R2010 = smd 1.8 x 2.7: 1 -2.2,0; 2 2.2,0
TRACOPOWER = drill 0.8 square: P$1 3.5,2; P$2 6.04,2; P$3 8.58,2
SSOP28 = smd 0.4 x 1.5: 1 -4.225,-3.625; 2 -3.575,-3.625; 3 -2.925,-3.625; 4 -2.275,-3.625; 5 -1.625,-3.625; 6 -0.975,-3.625; 7 -0.325,-3.625; 8 0.325,-3.625; 9 0.975,-3.625; 10 1.625,-3.625; 11 2.275,-3.625; 12 2.925,-3.625; 13 3.575,-3.625; 14 4.225,-3.625; 15 4.225,3.625; 16 3.575,3.625; 17 2.925,3.625; 18 2.275,3.625; 19 1.625,3.625; 20 0.975,3.625; 21 0.325,3.625; 22 -0.325,3.625; 23 -0.975,3.625; 24 -1.625,3.625; 25 -2.275,3.625; 26 -2.925,3.625; 27 -3.575,3.625; 28 -4.225,3.625
MODULE_ESP32-WROOM-32E_(16MB) = smd 2 x 0.9: 1 -8.5,5.26; 2 -8.5,3.99; 3 -8.5,2.72; 4 -8.5,1.45; 5 -8.5,0.18; 6 -8.5,-1.09; 7 -8.5,-2.36; 8 -8.5,-3.63; 9 -8.5,-4.9; 10 -8.5,-6.17; 11 -8.5,-7.44; 12 -8.5,-8.71; 13 -8.5,-9.98; 14 -8.5,-11.25; 25 8.5,-11.25; 26 8.5,-9.98; 27 8.5,-8.71; 28 8.5,-7.44; 29 8.5,-6.17; 30 8.5,-4.9; 31 8.5,-3.63; 32 8.5,-2.36; 33 8.5,-1.09; 34 8.5,0.18; 35 8.5,1.45; 36 8.5,2.72; 37 8.5,3.99; 38 8.5,5.26 | smd 0.9 x 2: 15 -5.715,-12.25; 16 -4.445,-12.25; 17 -3.175,-12.25; 18 -1.905,-12.25; 19 -0.635,-12.25; 20 0.635,-12.25; 21 1.905,-12.25; 22 3.175,-12.25; 23 4.445,-12.25; 24 5.715,-12.25 | smd 1.33 x 1.33: 39_1 -2.835,-0.405; 39_2 -1,-0.405; 39_3 0.835,-0.405; 39_4 -2.835,-2.24; 39_5 -1,-2.24; 39_6 0.835,-2.24; 39_7 -2.835,-4.075; 39_8 -1,-4.075; 39_9 0.835,-4.075 | drill 0.2 pad 0.3: 39_10 -1.917,-0.405; 39_11 -0.083,-0.405; 39_12 -2.835,-1.323; 39_13 -1,-1.323; 39_14 0.835,-1.323; 39_15 -1.917,-2.24; 39_16 -0.083,-2.24; 39_17 -2.835,-3.158; 39_18 -1,-3.158; 39_19 0.835,-3.158; 39_20 -1.917,-4.075; 39_21 -0.083,-4.075
SO8 = smd 1.981 x 0.533: 1 -2.464,1.905; 2 -2.464,0.635; 3 -2.464,-0.635; 4 -2.464,-1.905; 5 2.464,-1.905; 6 2.464,-0.635; 7 2.464,0.635; 8 2.464,1.905
SOT95P280X145-6N = smd 1.37 x 0.59: 1 -1.17,0.95; 2 -1.17,0; 3 -1.17,-0.95; 4 1.17,-0.95; 5 1.17,0; 6 1.17,0.95
L102011ML04Q = drill 2 square: P$1 0,0; P$2 0,4.75; P$3 0,9.5
STAND-OFF = hole 3.302: 0,0
SOT223 = smd 1.219 x 2.235: 1 -2.311,-3.099; 2 0,-3.099; 3 2.311,-3.099 | smd 7 x 6: 4 0,3.099

### Placement (x,y rotation side)
B1  78.41,72.24 90 top
C1  65.72,35.32 300 top
C2  122.24,77.47 60 top
C3  64.7,106.66 180 top
C4  148.16,39.68 240 top
C5  22.72,39.84 120 top
C6  84.25,144.76 0 top
C7  106.12,101.65 90 top
C8  108.41,101.52 270 top
C9  101.4,43.54 180 top
C10  91.65,23.32 0 top
C11  91.65,17.73 0 top
C12  102.01,14.1 270 top
C13  87.94,72.77 0 top
C14  87.96,74.88 0 top
C15  52.86,79.27 120 top
C16  45.11,84.51 30 top
C17  112.85,89.92 0 top
C19  38.46,118.99 240 top
C20  21.71,91.19 60 top
D1  38.86,80.49 300 top
D3  82.53,23.01 0 top
J1  82.48,17.76 90 top
J2  115.56,81.15 300 top
J3  70.78,43.65 210 top
J4  120.11,75.11 330 top
J5  67.49,103.03 90 top
J6  21.38,101.43 330 top
L1  42.89,73.95 300 top
LED1  151.69,37.44 60 top
LED2  151.69,37.44 120 bottom
LED3  18.72,38.2 300 top
LED4  18.72,38.2 240 bottom
LED5  84.38,148.82 180 top
LED6  84.38,148.82 0 bottom
Q1  107.39,97.33 0 top
Q2  103.71,97.33 0 top
Q3  79.68,63.48 0 top
Q4  56.43,103.45 60 top
Q5  99.09,14.22 0 top
Q6  94.9,14.22 0 top
Q7  109.4,90.68 0 top
R1  98.96,17.91 270 top
R2  46.4,81.27 210 top
R3  105.74,90.86 0 top
R4  42.71,81.39 210 top
R5  102.06,90.86 0 top
R6  62.41,97.64 180 top
R7  110.95,101.52 90 top
R8  81.08,59.28 0 top
R9  102.69,102.67 0 top
R10  100.66,97.46 270 top
R11  109.43,93.9 180 top
R12  91.65,21.54 0 top
R13  91.65,19.63 0 top
R14  35.39,86.61 300 top
R15  94.9,17.91 90 top
R16  97.18,10.8 0 top
R17  97.18,8.76 180 top
R18  112.85,91.87 0 top
REG1  83.97,76.56 0 top
U1  101.53,36.93 270 top
U2  84.66,38.2 180 top
U3  111.08,97.33 0 top
U4  69.39,37.69 300 top
U5  126.81,76.46 60 top
U6  62.16,110.59 180 top
U7  49.64,77.32 300 top
U$1  116.94,106.4 210 top
U$2  [STAND-OFF]  39.04,8.61 45 top
U$3  [STAND-OFF]  62.16,6.45 45 top
U$4  [STAND-OFF]  108.13,6.58 45 top
U$5  [STAND-OFF]  131.24,8.61 45 top
U$6  [STAND-OFF]  164.52,66.14 45 top
U$8  [STAND-OFF]  154.61,87.1 45 top
U$9  [STAND-OFF]  131.75,126.98 45 top
U$10  [STAND-OFF]  118.54,145.77 45 top
U$11  [STAND-OFF]  51.87,145.77 45 top
U$15  [STAND-OFF]  5.89,66.27 45 top
U$25  89.08,67.23 180 top
U$31  [STAND-OFF]  51.36,65.51 45 top
U$33  [STAND-OFF]  61.52,48.36 45 top
U$35  [STAND-OFF]  118.67,65.51 45 top
U$36  [STAND-OFF]  109.15,48.36 45 top
U$38  [STAND-OFF]  75.49,106.78 45 top
U$39  [STAND-OFF]  95.18,106.78 45 top

### Tracks (layer width: path | path; a pad name or v marks a point on that pad's centre or on a via)
3.3V  (via drill 0.3)
  Top 0.203: R1.1 98.82,18.86 94.92,18.86 R15.2 94.77,18.86 94.77,20.81 | 94.77,20.81 94.77,33.26 93.87,34.16 93.27,34.16 U2.2 | 113.22,52.61 125.82,65.21 125.82,70.16 J4.2 | 113.22,52.61 113.22,43.31 106.77,36.86 106.77,32.81 94.77,20.81 | 80.67,73.16 78.42,75.41 B1.P$2 | 80.67,73.16 83.37,70.46 86.67,70.46 U$25.3 | v70.47,51.86 70.47,62.96 80.67,73.16 | 113.22,52.61 93.57,52.61 85.02,61.16 v85.02,66.86
  Top 0.406: C14.1 87.04,74.88 C13.1 87.04,70.6 U$25.3
  Bottom 0.203: J3.2 63.72,41.06 63.72,45.11 v70.47,51.86 70.47,108.86 68.82,110.51 J5.2 | v85.02,66.86 85.02,68.81 78.42,75.41 B1.P$2
BUZZER  (via drill 0.3)
  Top 0.203: v83.97,57.26 82.02,59.21 R8.2 | v90.12,41.96 93.12,41.96 U2.8
  Bottom 0.203: v83.97,57.26 83.97,48.11 v90.12,41.96
DTR  (via drill 0.3)
  Top 0.203: 96.12,12.86 95.97,13.01 Q6.2 96.12,12.86 | 96.12,12.86 96.27,12.71 96.27,10.91 R16.1 | v101.52,38.06 101.52,38.96 100.02,40.46 97.92,40.46 U1.2 | 96.12,12.86 v96.12,16.31
  Bottom 0.203: v101.52,38.06 103.47,36.11 103.47,35.51 96.57,28.61 96.12,28.61 92.82,25.31 92.82,19.61 v96.12,16.31
EN  (via drill 0.3)
  Top 0.203: C12.1 101.97,15.11 99.27,15.11 99.12,15.26 Q5.3 98.97,15.41 98.97,16.91 R1.2 98.82,17.06 v97.92,17.96 | v95.52,26.96 95.52,33.86 94.02,35.36 93.27,35.36 U2.3
  Bottom 0.203: v95.52,26.96 97.92,24.56 v97.92,17.96
GND  (via drill 0.3, 0.6)
  Top 0.406: U1.7 101.4,37.26 101.94,36.72 | 101.94,36.72 102.05,36.61 102.36,36.61 | 102.36,36.61 U1.21 | U1.18 103.02,34.66 101.94,34.66 101.94,36.72 | U1.25 v102.36,39.21 102.36,36.61
  Top 0.508: C4.2 147.72,38.81 147.72,37.46 148.92,36.26 LED1.3-GND 149.22,36.11 v150.72,34.61 | C9.2 100.62,43.46 100.62,40.91 102.27,39.26 v102.36,39.21 | U1.26 105.27,39.71 105.27,39.26 U1.25 | C11.1 90.87,17.81 91.62,18.56 91.62,22.46 90.87,23.21 C10.1 | v101.97,12.11 101.97,13.16 C12.2 | C10.1 90.57,23.21 89.22,23.21 83.82,17.81 J1.GND | v103.02,34.01 103.02,34.66 | U2.39_7 87.42,42.26 86.67,42.26 U2.39_20 86.37,42.26 85.92,42.26 U2.39_8 85.62,42.26 84.87,42.26 U2.39_21 84.72,42.26 83.97,42.26 U2.39_9 | U2.39_6 83.82,40.31 83.82,39.71 U2.39_14 83.82,39.41 83.82,38.66 U2.39_3 83.67,38.51 78.27,33.11 76.32,33.11 U2.38 76.02,32.96 75.27,32.96 74.37,33.86 | U2.39_19 83.82,41.21 83.82,40.61 U2.39_6 | U2.39_5 85.62,40.46 84.87,40.46 U2.39_16 84.57,40.46 83.97,40.46 U2.39_6 | U2.39_18 85.62,41.21 85.62,40.61 U2.39_5 | U2.39_2 85.62,38.66 84.87,38.66 U2.39_11 | U2.39_13 85.62,39.41 85.62,38.81 U2.39_2 | U2.39_4 87.57,40.31 87.57,39.71 U2.39_12 87.57,39.41 87.57,38.66 U2.39_1 87.27,38.66 86.67,38.66 U2.39_10 | U2.39_4 87.27,40.46 86.67,40.46 U2.39_15 86.37,40.46 85.92,40.46 U2.39_5 | U2.39_4 87.57,40.61 87.57,41.21 U2.39_17 87.42,41.51 87.42,42.11 U2.39_7 | U2.39_10 86.67,38.51 92.22,32.96 93.12,32.96 U2.1 93.27,32.81 94.02,32.06 94.02,25.31 93.87,25.16 92.52,25.16 90.87,23.51 C10.1 | U2.39_2 85.92,38.66 86.37,38.66 U2.39_10 | C1.2 66.27,34.61 U4.5 69.12,34.46 69.42,34.46 70.17,33.71 74.22,33.71 74.37,33.86 | 74.37,33.86 72.42,35.81 72.42,36.41 U4.8 72.12,36.71 72.12,40.01 69.72,42.41 68.82,42.41 68.07,43.16 67.62,43.16 J3.5 | 124.92,78.26 125.07,78.26 125.52,78.71
  Top 0.508: 124.92,78.26 122.82,78.26 C2.2 | 125.52,78.71 126.27,79.46 U5.8 | 125.52,78.71 127.47,76.76 128.52,76.76 129.27,77.51 129.57,77.51 U5.5 | 122.07,74.51 122.07,75.26 124.92,78.11 124.92,78.26 | 122.07,74.51 122.07,72.56 J4.5 | v105.72,97.31 104.67,98.36 Q2.4 | R11.2 108.42,94.01 107.97,94.46 v107.52,94.46 107.37,94.31 104.67,94.31 101.22,90.86 R5.1 101.07,90.71 101.07,85.01 93.42,77.36 89.97,77.36 | C14.2 88.92,74.81 88.92,72.86 C13.2 88.92,72.56 88.92,70.61 89.07,70.46 U$25.2 | 89.22,70.31 U$25.2 | 89.97,77.36 89.97,76.16 88.92,75.11 C14.2 | 89.97,77.36 89.97,78.41 REG1.P$2 89.82,78.71 65.59,102.94 | U$25.2 88.92,70.16 87.87,69.11 87.87,68.96 86.67,67.76 84.72,67.76 80.82,63.86 80.82,62.51 Q3.2 80.67,62.36 90.27,52.76 90.27,50.51 U2.15 90.42,50.21 90.42,49.61 87.72,46.91 87.72,42.41 U2.39_7 | 122.07,74.51 89.07,74.51 C14.2 | 49.02,78.41 U7.2 48.87,78.56 48.87,79.01 47.97,79.91 | 47.97,79.91 47.37,80.51 47.37,81.56 R2.1 47.07,81.86 47.07,83.66 45.87,84.86 C16.2 45.87,85.16 45.87,94.61 49.32,98.06 v49.71,99.29 | C15.2 52.32,80.06 48.12,80.06 47.97,79.91 | C5.2 22.17,40.76 19.32,40.76 19.02,41.06 LED3.3-GND 18.72,41.06 v17.22,39.56 | C6.2 85.17,144.86 85.17,145.46 86.82,147.11 LED5.3-GND 86.82,147.41 v86.82,148.31 | R6.1 63.42,97.76 63.42,100.61 v63.93,101.7 64.92,102.26 65.59,102.94 | 63.87,104.66 63.87,103.16 63.24,102.12 | 63.87,104.66 63.87,106.61 C3.2 | 63.87,104.66 63.72,104.66 59.82,108.56 U6.8 59.52,108.86 58.77,108.86 58.17,109.46 58.17,111.71 58.92,112.46 59.67,112.46 U6.5 | 65.59,102.94 68.67,106.01 J5.5
  Top 2.184: C19.- 37.91,104.99
  Top 2.54: C20.- 33.07,97 37.91,104.99 38.15,105.39 v49.71,99.29 | Q4.2 63.24,102.12 v63.93,101.7
  Bottom 0.406: v102.36,39.21 102.34,39.21 102.34,39.19
  Bottom 0.508: LED2.3-GND 151.77,34.61 v150.72,34.61 150.57,34.46 150.57,32.81 124.47,6.71 111.27,6.71 106.02,11.96 102.12,11.96 v101.97,12.11 98.97,12.11 | 98.97,12.11 94.47,12.11 88.92,17.66 83.82,17.66 J1.GND | v103.02,34.01 103.02,27.26 98.97,23.21 98.97,12.11 | v105.72,97.31 105.72,96.26 v107.52,94.46 | v17.22,39.56 16.17,39.56 LED4.3-GND 16.02,39.71 16.02,56.51 8.22,64.31 8.22,70.61 8.07,70.76 8.07,79.31 22.02,93.26 22.92,93.26 C20.- | v86.82,148.31 86.82,149.21 | 86.82,149.21 86.82,150.41 LED6.3-GND | 86.82,149.21 52.17,149.21 38.52,135.56 38.52,122.66 37.32,121.46 37.32,116.81 C19.-
  Bottom 2.54: v63.93,101.7 v49.71,99.29
  other vias: 133.71,92.43
  pour Bottom: -19.07,180.29 206.78,180.29 206.78,-26.62 -50.95,-26.62 -50.95,94.54
  pour Top: -22.91,174.52 182.2,174.52 182.2,-13.16 -55.19,-13.16 -55.19,108.38
GND_RAW  (via drill 0.3)
  Top 0.508: 108.72,98.51 110.07,98.51 U3.6 | 108.72,98.51 108.42,98.51 Q1.4 | 106.02,99.41 107.97,99.41 108.72,98.66 108.72,98.51 | 106.02,99.41 102.27,99.41 101.97,99.11 101.97,97.76 100.77,96.56 R10.2 | C8.1 108.27,102.41 106.17,102.41 C7.2 105.87,102.56 v104.82,102.56 | R18.1 111.87,91.91 110.37,91.91 Q7.4 110.37,91.61 v110.37,90.71 | v106.02,99.56 106.02,99.41
  Bottom 0.508: J2.3 115.17,81.11 115.17,83.21 110.37,88.01 v110.37,90.71 110.22,90.86 110.22,95.66 106.17,99.71 | v104.82,102.56 104.82,101.06 106.17,99.71 | v106.02,99.56 106.17,99.71
IO0  (via drill 0.3)
  Top 0.203: Q6.3 94.92,15.41 94.92,16.91 R15.1 94.77,17.06 v93.57,17.06 | v62.52,41.51 69.57,48.56 74.52,48.56 75.27,49.31 76.02,49.31 U2.25
  Bottom 0.203: v93.57,17.06 93.12,17.06 85.92,24.26 76.92,24.26 61.32,39.86 61.32,40.76 62.07,41.51 v62.52,41.51
KICK  (via drill 0.3)
  Top 0.203: Q4.1 59.52,98.96 60.72,97.76 61.47,97.76 R6.2 61.62,97.61 71.97,87.26 v71.97,73.31 | v81.72,63.56 96.27,49.01 96.27,45.56 93.87,43.16 93.27,43.16 U2.9
  Bottom 0.203: v71.97,73.31 v81.72,63.56
KICKER
  Top 2.54: J6.2 Q4.3
LEDS  (via drill 0.3)
  Top 0.203: v97.02,14.36 97.02,8.36 100.92,4.46 122.07,4.46 151.77,34.16 151.77,34.46 LED1.4-DIN | v88.77,37.76 88.77,42.56 91.77,45.56 91.77,46.16 92.52,46.91 U2.12
  Bottom 0.203: v97.02,14.36 94.32,17.06 94.32,17.51 87.27,24.56 87.27,36.26 v88.77,37.76
M1A
  Top 0.203: U4.6 70.02,35.36 69.42,35.36 68.82,35.96 66.72,35.96 66.12,35.36 65.52,35.36 65.22,35.06 64.77,35.06 61.32,38.51 61.32,41.36 68.97,49.01 73.77,49.01 76.62,51.86 88.32,51.86 89.07,51.11 89.07,50.51 U2.16
M1B  (via drill 0.3)
  Top 0.203: v71.22,37.76 71.22,35.96 U4.7 | v85.17,47.96 v80.52,43.31 | v91.47,47.96 92.97,47.96 93.12,48.11 U2.13
  Bottom 0.203: v71.22,37.76 74.97,37.76 v80.52,43.31 | v91.47,47.96 v85.17,47.96
M1C1
  Top 0.203: U2.26 76.02,48.11 70.32,48.11 66.27,44.06 66.27,42.56 J3.4
M1C2  (via drill 0.3)
  Top 0.203: U2.27 70.17,46.91 v68.37,45.11
  Bottom 0.203: v68.37,45.11 67.32,45.11 65.07,42.86 65.07,41.81 J3.3
M1P1  (via drill 0.3)
  Top 0.508: v68.22,41.66 68.67,41.66 69.42,40.91 69.72,40.91 U4.1
  Bottom 0.508: v68.22,41.66 68.22,42.26 68.82,42.86 68.82,43.91 J3.6
M1P2
  Top 0.508: U4.4 66.42,38.96 63.57,38.96 62.37,40.16 J3.1
M2A  (via drill 0.3)
  Top 0.203: v112.92,96.41 128.67,80.66 128.67,78.41 U5.6 | v77.82,48.11 77.82,46.61 76.92,45.71 76.17,45.71 U2.28
  Bottom 0.203: v112.92,96.41 112.02,96.41 105.12,103.31 104.52,103.31 82.17,80.96 82.17,72.26 85.77,68.66 85.77,65.51 77.82,57.56 v77.82,48.11
M2B  (via drill 0.3)
  Top 0.203: v127.62,80.66 127.62,79.01 U5.7 | v78.57,48.86 78.57,44.81 76.92,43.16 76.17,43.16 U2.30
  Bottom 0.203: v127.62,80.66 120.12,80.66 114.57,75.11 108.72,75.11 103.62,80.21 103.62,86.51 103.17,86.96 91.47,86.96 86.37,81.86 86.37,76.46 87.87,74.96 87.87,67.01 78.57,57.71 v78.57,48.86
M2C1  (via drill 0.3)
  Top 0.203: v84.72,48.86 77.82,41.96 76.17,41.96 U2.31 | v94.77,58.91 105.87,58.91 118.32,71.36 122.97,71.36 123.27,71.66 J4.4
  Bottom 0.203: v94.77,58.91 v84.72,48.86
M2C2  (via drill 0.3)
  Top 0.203: v87.12,48.86 77.67,39.41 76.17,39.41 U2.33 | v94.77,56.51 104.07,56.51 118.17,70.61 124.32,70.61 124.62,70.91 J4.3
  Bottom 0.203: v94.77,56.51 v87.12,48.86
M2P1  (via drill 0.3)
  Top 0.508: v122.97,73.91 123.87,74.81 123.87,75.26 U5.1
  Bottom 0.508: v122.97,73.91 121.47,73.91 120.87,73.31 J4.6
M2P2
  Top 0.508: U5.4 127.32,73.31 127.32,69.56 J4.1
M3A  (via drill 0.3)
  Top 0.203: v62.97,111.26 59.82,111.26 U6.6 | v71.22,42.11 71.22,41.81 74.82,38.21 74.82,36.11 75.42,35.51 76.02,35.51 U2.36
  Bottom 0.203: v62.97,111.26 66.72,111.26 68.52,113.06 69.12,113.06 71.22,110.96 v71.22,42.11
M3B  (via drill 0.3)
  Top 0.203: v61.47,109.46 61.02,109.91 59.82,109.91 U6.7 | v69.72,49.76 v69.72,52.46 | v74.52,35.21 75.42,34.31 76.02,34.31 U2.37
  Bottom 0.203: v61.47,109.46 61.47,108.56 70.02,100.01 70.02,52.76 v69.72,52.46 | v69.72,49.76 69.72,44.36 69.87,44.21 69.87,40.01 69.27,39.41 69.27,38.66 72.72,35.21 v74.52,35.21
M3C1  (via drill 0.3)
  Top 0.203: v95.52,46.01 94.02,44.51 93.27,44.51 U2.10 | v91.32,85.76 90.12,85.76 69.72,106.16 69.72,106.61 68.82,107.51 J5.4
  Bottom 0.203: v95.52,46.01 95.52,81.56 v91.32,85.76
M3C2  (via drill 0.3)
  Top 0.203: v81.72,62.51 82.02,62.51 94.62,49.91 94.62,46.46 93.87,45.71 93.27,45.71 U2.11 | v74.22,102.71 73.77,102.71 70.17,106.31 70.17,107.66 68.82,109.01 J5.3
  Bottom 0.203: v81.72,62.51 82.47,63.26 82.47,69.41 74.22,77.66 v74.22,102.71
M3P1  (via drill 0.3)
  Top 0.508: v64.77,107.81 64.77,108.56 U6.1
  Bottom 0.508: v64.77,107.81 65.37,107.81 68.67,104.51 J5.6
M3P2
  Top 0.508: U6.4 64.77,112.46 68.37,112.46 68.67,112.16 J5.1
N$1
  Top 0.203: U7.1 49.92,78.71 49.92,78.11 50.07,77.96 50.07,77.81 49.02,76.76 42.12,76.76 L1.1
  Top 1.676: L1.1 D1.2
N$2
  Top 0.203: R4.2 41.82,80.96 39.57,80.96 38.52,82.01 D1.1 | C16.1 44.37,84.11 37.77,84.11 37.04,83.71
  Top 1.676: D1.1 37.04,83.71 R14.2
N$3
  Top 0.203: R8.1 80.07,59.36 80.07,61.16 78.87,62.36 Q3.1
N$4
  Top 0.203: 45.12,80.96 44.37,80.96 43.62,81.71 R4.1 | 45.12,80.96 45.57,80.96 R2.2 45.12,80.96 | 45.12,80.96 48.12,77.96 U7.3
N$5
  Top 0.203: Q3.3 79.62,64.61 79.62,67.61 78.42,68.81 B1.P$1
N$6  (via drill 0.3)
  Top 0.203: v94.77,41.21 97.77,41.21 U1.1 | v82.32,43.01 81.87,43.01 76.92,38.06 76.17,38.06 U2.34
  Bottom 0.203: v94.77,41.21 88.62,41.21 86.82,43.01 v82.32,43.01
N$7
  Bottom 0.508: U$1.P$2 119.22,102.26 119.22,98.96 118.32,98.06 118.32,79.76 116.37,77.81 110.22,77.81 110.07,77.96 J2.2
N$8
  Top 0.203: U3.5 110.97,98.51 110.97,100.61 R7.1 110.82,100.61 C8.2
N$9
  Top 0.203: R10.1 100.77,98.36 100.77,99.86 103.47,102.56 R9.2 103.62,102.56 105.42,100.76 106.02,100.76 C7.1 106.17,100.76 106.77,101.36 111.72,101.36 112.02,101.06 112.02,98.51 U3.4
N$10
  Top 0.203: 102.87,96.26 103.62,96.26 Q2.2 103.77,96.11 103.77,95.81 104.22,95.36 105.57,95.36 106.32,96.11 Q1.1 106.47,96.26 | Q2.5 103.62,98.51 102.87,98.51 Q2.6 102.87,98.36 102.87,96.26 | 102.87,96.26 Q2.1 | 106.47,96.26 107.37,96.26 Q1.2 | Q1.5 107.37,98.51 106.47,98.51 Q1.6 106.47,98.36 106.47,96.26
N$11  (via drill 0.3)
  Top 0.203: v104.52,97.31 104.52,96.26 Q2.3 | v107.37,97.31 110.22,97.31 110.97,96.56 110.97,96.26 U3.2
  Bottom 0.203: v104.52,97.31 105.27,98.06 106.62,98.06 v107.37,97.31
N$12
  Top 0.203: Q1.3 108.42,96.26 110.07,96.26 U3.1
N$13
  Top 0.203: Q7.2 109.32,89.51 108.57,89.51 Q7.1 108.57,89.66 108.57,91.76 Q7.6 108.57,91.91 109.32,91.91 Q7.5 109.47,91.91 109.47,93.11 110.22,93.86 R11.1 110.37,94.01 112.02,95.66 112.02,96.11 U3.3
N$14  (via drill 0.3)
  Top 0.203: v94.77,38.51 97.77,38.51 U1.5 | v82.32,38.36 78.42,38.36 76.92,36.86 76.17,36.86 U2.35
  Bottom 0.203: v94.77,38.51 87.57,38.51 86.97,37.91 82.77,37.91 v82.32,38.36
N$15  (via drill 0.3)
  Top 0.203: U1.17 105.27,34.01 106.02,34.01 106.32,34.31 106.32,41.51 104.37,43.46 102.42,43.46 C9.1 102.27,43.46 v102.27,42.26 | v99.27,39.26 97.92,39.26 U1.4
  Bottom 0.203: v102.27,42.26 v99.27,39.26
N$16
  Top 0.203: R16.2 98.07,10.91 98.07,13.01 Q5.1
N$17
  Top 0.203: R17.2 96.27,8.81 96.27,9.26 94.02,11.51 94.02,13.01 Q6.1
N$19
  Top 0.203: 112.77,90.86 111.42,90.86 111.12,90.56 111.12,90.41 110.37,89.66 Q7.3 | 112.77,90.86 113.67,91.76 R18.2 | 112.77,90.86 113.67,89.96 C17.2
N$27  (via drill 0.3)
  Top 0.203: v149.07,37.91 151.47,40.31 LED1.2-DOUT
  Bottom 0.203: v149.07,37.91 149.07,36.26 LED2.4-DIN
N$28  (via drill 0.3)
  Top 0.203: v47.97,4.31 16.17,36.11 16.17,39.41 LED3.4-DIN
  Bottom 0.203: v47.97,4.31 123.12,4.31 154.32,35.51 154.32,38.66 LED2.2-DOUT
N$30  (via drill 0.3)
  Top 0.203: v84.72,147.56 84.72,148.31 86.82,150.41 LED5.4-DIN
  Bottom 0.203: v84.72,147.56 80.82,143.66 50.37,143.66 44.97,138.26 44.97,122.06 28.62,105.71 28.62,102.11 3.72,77.21 3.72,65.51 8.07,61.16 8.07,46.01 18.42,35.66 18.42,35.36 LED4.2-DOUT
N$32  (via drill 0.3)
  Top 0.203: v82.02,148.31 82.02,147.26 LED5.2-DOUT
  Bottom 0.203: v82.02,148.31 85.77,148.31 86.82,147.26 LED6.4-DIN
N$39  (via drill 0.3)
  Top 0.203: v19.02,39.26 21.27,37.01 LED3.2-DOUT
  Bottom 0.203: v19.02,39.26 19.02,41.06 LED4.4-DIN
N$59  (via drill 0.3)
  Top 0.203: v88.17,20.96 88.62,21.41 90.72,21.41 R12.1
  Bottom 0.203: v88.17,20.96 82.47,20.96 81.27,19.76 J1.D-
N$60
  Top 0.203: R13.1 90.72,19.61 87.27,19.61 84.12,16.46 82.47,16.46 81.27,17.66 J1.D+
RTS  (via drill 0.3)
  Top 0.203: R17.1 98.22,8.81 98.22,9.41 100.02,11.21 100.02,13.01 Q5.2 100.17,13.16 101.22,14.21 v103.02,14.21 | v100.32,39.11 100.32,39.26 99.57,40.01 98.97,40.01 98.82,39.86 U1.3
  Bottom 0.203: v100.32,39.11 100.77,39.11 101.82,40.16 102.87,40.16 103.92,39.11 103.92,27.26 99.57,22.91 99.57,17.66 v103.02,14.21
USBDM  (via drill 0.3)
  Top 0.203: 92.52,22.91 92.52,23.21 C10.2 92.52,22.91 | 92.52,22.91 92.52,21.56 R12.2 | v95.52,25.91 102.87,33.26 105.12,33.26 U1.16 | 92.52,22.91 v93.57,23.96
  Bottom 0.203: v93.57,23.96 v95.52,25.91
USBDP  (via drill 0.3)
  Top 0.203: C11.2 92.52,17.81 92.52,19.61 R13.2 92.67,19.76 93.57,20.66 v93.57,21.11 | v95.52,23.06 105.12,32.66 U1.15
  Bottom 0.203: v93.57,21.11 v95.52,23.06
VCC  (via drill 0.3)
  Top 0.508: 23.07,37.01 23.07,36.56 21.87,35.36 18.57,35.36 LED3.1-VDD | 23.07,37.01 23.07,38.96 C5.1 | v22.92,37.01 23.07,37.01 | 152.07,41.81 151.32,41.81 v150.72,41.21 150.12,40.61 148.62,40.61 C4.1 | 152.07,41.81 154.32,39.56 154.32,38.81 LED1.1-VDD | 83.22,147.26 83.22,149.21 82.02,150.41 LED5.1-VDD | 83.22,147.26 83.22,144.86 C6.1 83.52,144.56 86.07,142.01 121.77,142.01 125.52,138.26 125.52,113.66 124.47,112.61 | v83.37,147.26 83.22,147.26 | v81.42,25.01 81.42,23.06 D3.1 81.12,23.06 75.57,23.06 v59.22,6.71 | v92.67,70.31 91.47,70.31 U$25.1 | 124.47,112.61 120.87,109.01 106.47,109.01 94.92,97.46 94.92,80.21 93.27,78.56 92.67,78.56 REG1.P$3 | 124.47,112.61 162.27,74.81 162.27,62.96 152.22,52.91 152.22,41.96 152.07,41.81
  Bottom 0.508: LED4.1-VDD 21.42,37.01 v22.92,37.01 23.07,36.86 23.07,29.36 45.72,6.71 v59.22,6.71 | v150.72,41.21 151.47,40.46 LED2.1-VDD | v83.37,147.26 82.02,147.26 LED6.1-VDD | v81.42,25.01 81.42,58.61 92.52,69.71 92.52,70.31 | 92.52,70.31 92.52,78.41 REG1.P$3 | v92.67,70.31 92.52,70.31
VIN  (via drill 0.3, 0.6)
  Top 0.508: 107.22,89.36 107.97,88.61 110.97,88.61 111.57,89.21 | 107.22,89.36 106.77,89.81 106.77,90.71 R3.2 | 111.57,89.21 111.87,89.51 111.87,89.81 C17.1 | v120.86,78.57 118.32,81.11 118.32,82.46 112.32,88.46 | 121.04,78.39 121.77,77.66 121.77,76.76 C2.1 | 111.57,89.21 112.32,88.46 | U5.2 125.07,74.51 125.52,74.06 126.12,74.06 U5.3 126.27,74.21 126.57,74.21 | U$1.P$1 116.82,106.31 113.07,102.56 110.97,102.56 R7.2 110.82,102.71 109.77,103.76 102.87,103.76 101.82,102.71 R9.1 | v112.77,88.91 112.32,88.46 | 68.67,39.56 68.67,40.01 U4.2 | 68.67,39.56 68.67,39.11 | 68.67,39.11 68.67,38.81 65.97,36.11 65.37,36.11 C1.1 | 68.67,39.56 67.62,39.56 U4.3 | 65.29,110.59 64.77,111.11 U6.3 | 65.29,110.59 66.12,109.76 66.12,108.26 65.67,107.81 65.67,106.76 C3.1 65.52,106.46 65.52,104.06 v65.22,103.76 | 65.29,110.59 64.77,110.06 U6.2 | 53.22,77.21 53.22,78.41 C15.1 | 53.22,77.21 51.57,75.56 50.82,75.56 50.37,76.01 U7.5 50.22,76.16 49.92,75.86 49.47,75.86 U7.4 49.17,75.86 45.12,71.81 44.22,71.81 L1.2 | 65.82,72.41 58.02,72.41 53.22,77.21 | 65.82,72.41 72.27,72.41 78.27,78.41 87.42,78.41 REG1.P$1 | v65.82,72.56 65.82,72.41 | v70.02,39.11 68.67,39.11 | 107.22,89.36 94.32,76.46 v90.87,76.46
  Top 0.61: 126.57,74.21 126.11,74.21 v126.32,75.95 | v120.86,78.57 121.04,78.39
  Bottom 0.508: v112.77,88.91 112.77,95.06 116.67,98.96 116.67,106.16 116.82,106.31 U$1.P$1 | v65.22,103.76 65.22,103.01 65.82,102.41 v65.82,72.56 | v70.02,39.11 80.67,49.76 80.67,58.91 88.47,66.71 88.47,76.46 | 88.47,76.46 88.47,77.51 87.57,78.41 REG1.P$1 | 88.47,76.46 v90.87,76.46
  Bottom 0.61: v126.32,75.95 121.03,75.97 120.3,76.99 120.3,77.17 v120.86,78.57
VOLTAGE  (via drill 0.3)
  Top 0.203: R3.1 104.82,90.86 103.02,90.86 R5.2 102.87,90.71 v102.87,86.21 | v94.77,40.16 94.02,39.41 93.27,39.41 U2.6
  Bottom 0.203: v102.87,86.21 102.87,48.26 v94.77,40.16
VSTORE
  Top 0.203: C20.+ 20.52,89.06 20.34,89
  Top 2.184: 20.47,88.6 20.34,89 18.52,94.29 33.73,120.5 C19.+ J6.1
  Top 2.54: R14.1 20.91,88.51 C20.+
VUSB  (via drill 0.3)
  Top 0.203: 83.67,20.66 83.67,19.76 J1.VBUS | 83.67,20.66 83.67,22.91 D3.2 | v102.72,35.81 102.87,35.96 105.12,35.96 U1.20 | 83.67,20.66 v88.02,25.01
  Bottom 0.203: v102.72,35.81 98.82,35.81 v88.02,25.01

### Text on the board
tPlace: GND
tNames: Robot Soccer Kit rev1